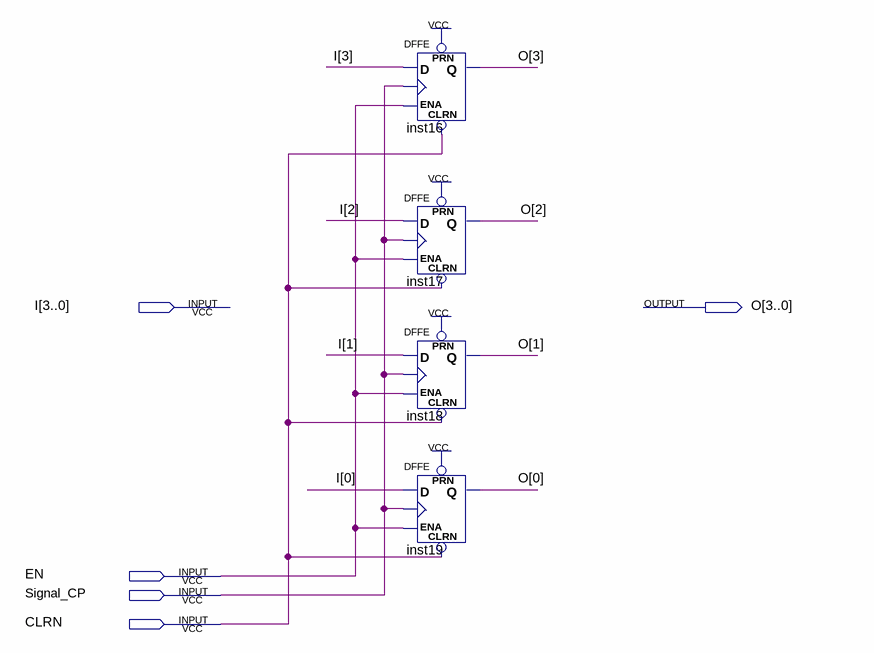
[diagram p0: schematic sheet]
// Quartus schematic 4bitDffC.bdf as structural Verilog: 4 symbols, 5 pins
module \4bitDffC  (
  input  [3:0] I,
  input  EN,
  input  Signal_CP,
  input  CLRN,
  output [3:0] O
);

  DFFE inst16 (.PRN(1'b1), .CLRN(CLRN), .D(I[3]), .CLK(Signal_CP), .ENA(EN), .Q(O[3]));
  DFFE inst17 (.PRN(1'b1), .CLRN(CLRN), .D(I[2]), .CLK(Signal_CP), .ENA(EN), .Q(O[2]));
  DFFE inst18 (.PRN(1'b1), .CLRN(CLRN), .D(I[1]), .CLK(Signal_CP), .ENA(EN), .Q(O[1]));
  DFFE inst19 (.PRN(1'b1), .CLRN(CLRN), .D(I[0]), .CLK(Signal_CP), .ENA(EN), .Q(O[0]));
endmodule
